# EAGLE design BackupPowerUnit (EAGLE 9.6.2)
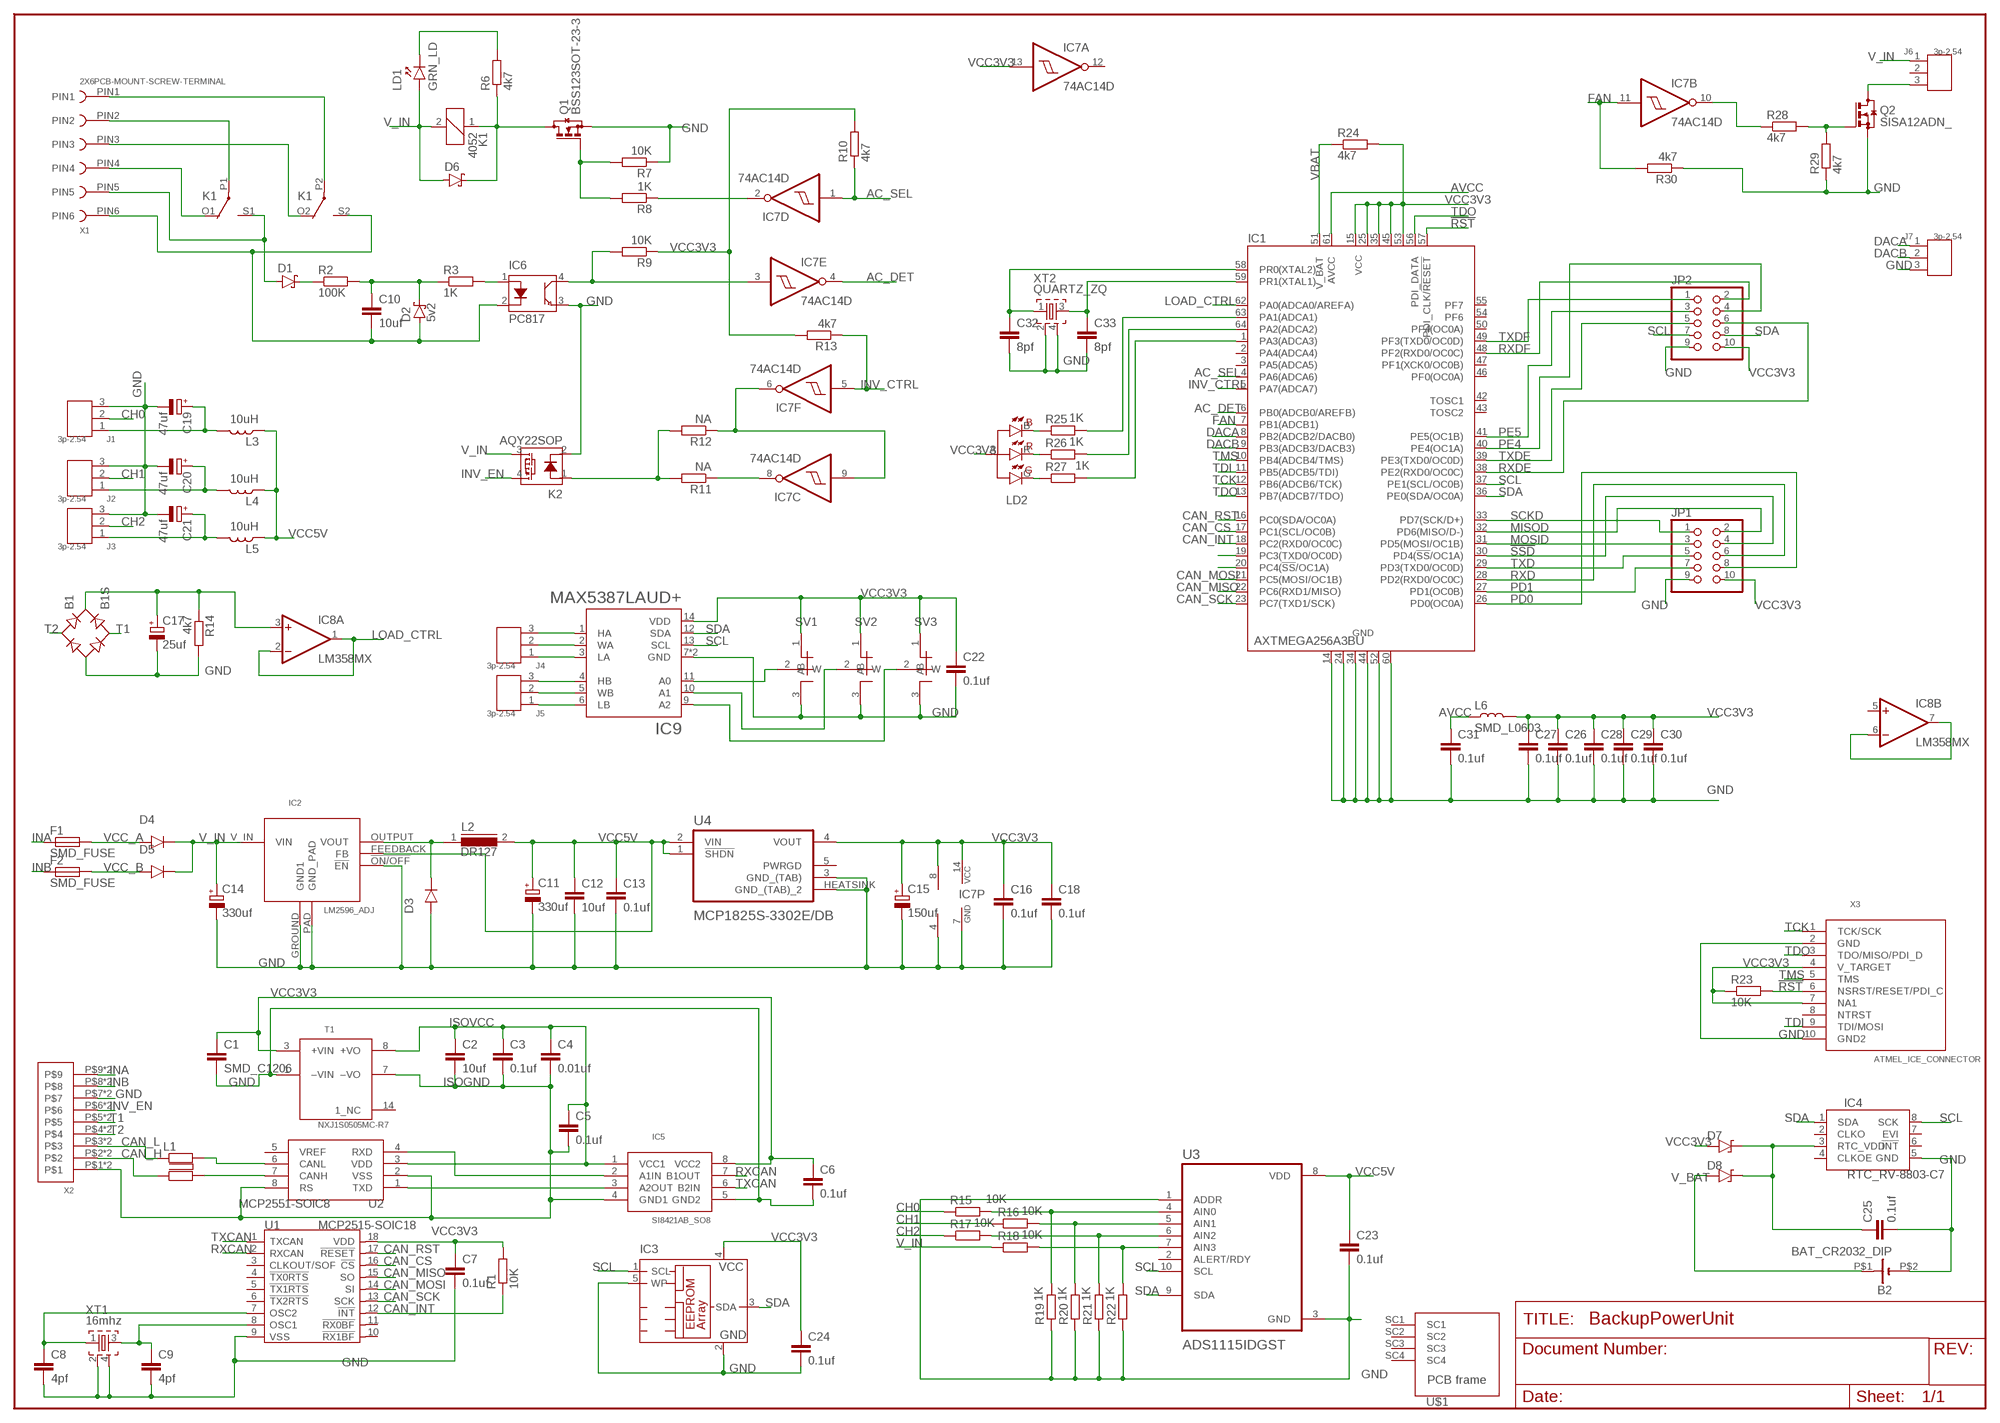
[diagram p0: schematic, sheet 1]

## Parts
B1  B1S  [MBS]
B2  BAT_CR2032_DIP  [CR2032_DIP]
C1  SMD_C1206  [1206]
C2  10uf  SMD_C1206  [1206]
C3  0.1uf  SMD_C0603  [0603]
C4  0.01uf  SMD_C0603  [0603]
C5  0.1uf  SMD_C0603  [0603]
C6  0.1uf  SMD_C0603  [0603]
C7  0.1uf  SMD_C0603  [0603]
C8  4pf  SMD_C0603  [0603]
C9  4pf  SMD_C0603  [0603]
C10  10uf  SMD_C0805  [0805]
C11  330uf  RADIAL_330UF_25V_8MM  [3.6MM]
C12  10uf  SMD_C1206  [1206]
C13  0.1uf  SMD_C0603  [0603]
C14  330uf  RADIAL_330UF_25V_8MM  [3.6MM]
C15  150uf  TANTAL_150UF_3528  [KA-3528ASYC]
C16  0.1uf  SMD_C0603  [0603]
C17  25uf  TANTAL_150UF_3528  [KA-3528ASYC]
C18  0.1uf  SMD_C0603  [0603]
C19  47uf  TANTAL_150UF_3528  [KA-3528ASYC]
C20  47uf  TANTAL_150UF_3528  [KA-3528ASYC]
C21  47uf  TANTAL_150UF_3528  [KA-3528ASYC]
C22  0.1uf  SMD_C0603  [0603]
C23  0.1uf  SMD_C0603  [0603]
C24  0.1uf  SMD_C0603  [0603]
C25  0.1uf  SMD_C0603  [0603]
C26  0.1uf  SMD_C0603  [0603]
C27  0.1uf  SMD_C0603  [0603]
C28  0.1uf  SMD_C0603  [0603]
C29  0.1uf  SMD_C0603  [0603]
C30  0.1uf  SMD_C0603  [0603]
C31  0.1uf  SMD_C0603  [0603]
C32  8pf  SMD_C0603  [0603]
C33  8pf  SMD_C0603  [0603]
D1  1N5819-B  [DO41-7.6]
D2  5v2  1N5819-B  [DO41-7.6]
D3  D_MBRA340G  [SMA403D]
D4  D_MBRA340G  [SMA403D]
D5  D_MBRA340G  [SMA403D]
D6  1N5819-B  [DO41-7.6]
D7  D_SOD323  [SOD-323_D]
D8  D_SOD323  [SOD-323_D]
F1  SMD_FUSE  [SMD_2410_FUSE_NOK]
F2  SMD_FUSE  [SMD_2410_FUSE_NOK]
IC1  AXTMEGA256A3BU  [TQFP64]
IC2  LM2596_ADJ  [DDPAK/TO-263(S)]
IC3  MICROCHIP-24AA01T-I/OT  [SOT-23(5)]
IC4  RTC_RV-8803-C7  [C7_RTC]
IC5  SI8421AB_SO8  [SO8]
IC6  PC817  [DIL4-SMD]
IC7  74AC14D  [SO14]
IC8  LM358MX  [SO08]
IC9  MAX5387LAUD+  [SOP65P640X110-14N]
J1  3p-2.54  DIP-MALE-JST(3P-2.54)  [H3-2.54-7.62X5.8MM]
J2  3p-2.54  DIP-MALE-JST(3P-2.54)  [H3-2.54-7.62X5.8MM]
J3  3p-2.54  DIP-MALE-JST(3P-2.54)  [H3-2.54-7.62X5.8MM]
J4  3p-2.54  DIP-MALE-JST(3P-2.54)  [H3-2.54-7.62X5.8MM]
J5  3p-2.54  DIP-MALE-JST(3P-2.54)  [H3-2.54-7.62X5.8MM]
J6  3p-2.54  DIP-MALE-JST(3P-2.54)  [H3-2.54-7.62X5.8MM]
J7  3p-2.54  DIP-MALE-JST(3P-2.54)  [H3-2.54-7.62X5.8MM]
JP1  PINHD-2X5  [2X05]
JP2  PINHD-2X5  [2X05]
K1  4052  [F4052]
K2  AQY22SOP  [SOP04]
L1  EPCOS_B82793_FILTER  [EPCOS_FILTER]
L2  DR127  [DR127]
L3  10uH  SMD_L0603  [0603]
L4  10uH  SMD_L0603  [0603]
L5  10uH  SMD_L0603  [0603]
L6  SMD_L0603  [0603]
LD1  GRN_LD  LED0603  [0603_P]
LD2  LTSN-N213EGBW(RGB_LED)  [LTSN-N213EGBW]
Q1  BSS123SOT-23-3  [SOT-23(3)]
Q2  SISA12ADN_  [VISHAY_SIS468DN-T1-GE3]
R1  10K  SMD_R0603  [0603]
R2  100K  R-EU_0204/7  [0204/7]
R3  1K  SMD_R0603  [0603]
R6  4k7  SMD_R0603  [0603]
R7  10K  SMD_R0603  [0603]
R8  1K  SMD_R0603  [0603]
R9  10K  SMD_R0603  [0603]
R10  4k7  SMD_R0603  [0603]
R11  NA  SMD_R0603  [0603]
R12  NA  SMD_R0603  [0603]
R13  4k7  SMD_R0603  [0603]
R14  4k7  SMD_R0603  [0603]
R15  10K  SMD_R0603  [0603]
R16  10K  SMD_R0603  [0603]
R17  10K  SMD_R0603  [0603]
R18  10K  SMD_R0603  [0603]
R19  1K  SMD_R0603  [0603]
R20  1K  SMD_R0603  [0603]
R21  1K  SMD_R0603  [0603]
R22  1K  SMD_R0603  [0603]
R23  10K  SMD_R0603  [0603]
R24  4k7  SMD_R0603  [0603]
R25  1K  SMD_R0603  [0603]
R26  1K  SMD_R0603  [0603]
R27  1K  SMD_R0603  [0603]
R28  4k7  SMD_R0603  [0603]
R29  4k7  SMD_R0603  [0603]
R30  4k7  SMD_R0603  [0603]
SV1  SMD_SWITCH_JUMPER  [0603_JUMP]
SV2  SMD_SWITCH_JUMPER  [0603_JUMP]
SV3  SMD_SWITCH_JUMPER  [0603_JUMP]
T1  NXJ1S0505MC-R7  [NXJ1SXXXXMC]
U1  MCP2515-SOIC18  [SO18L]
U2  MCP2551-SOIC8  [SO8]
U3  ADS1115IDGST  [SOP50P490X110-10N]
U4  MCP1825S-3302E/DB  [SOT230P700X180-4N]
U$1  JLC_PCB_FRAME80X100_FRAME  [80X100_PCB_FRAME]
X1  2X6PCB-MOUNT-SCREW-TERMINAL  [2X6PCB-MOUNT-SCREW-TERMINAL]
X2  WAGO250_X9  [WAGO250_FP_9X]
X3  ATMEL_ICE_CONNECTOR  [MINI10P_SPI/JTAG/PDI]
XT1  16mhz  QUARTZ_ZQ  [QUARTZ_3X3MM]
XT2  QUARTZ_ZQ  [QUARTZ_3X3MM]

## Nets
!RST: IC1.57(PDI_CLK/!RESET!) R23.2 X3.6(NSRST/RESET/PDI_C)
!SSD: IC1.30(PD4(!SS!/OC1A)) JP1.4
AC_DET: IC1.6(PB0(ADCB0/AREFB)) IC7.4(E:O)
AC_SEL: IC1.4(PA6(ADCA6)) IC7.1(D:I) R10.1
AVCC: C31.1 IC1.61(AVCC) L6.1
CAN_CS: IC1.17(PC1(SCL/OC0B)) U1.16(!CS)
CAN_H: L1.P$2 X2.P$2 X2.U$2
CAN_INT: IC1.18(PC2(RXD0/OC0C)) R1.1 U1.12(!INT)
CAN_L: L1.P$1 X2.P$3 X2.U$3
CAN_MISO: IC1.22(PC6(RXD1/MISO)) U1.15(SO)
CAN_MOSI: IC1.21(PC5(MOSI/OC1B)) U1.14(SI)
CAN_RST: IC1.16(PC0(SDA/OC0A)) U1.17(!RESET)
CAN_SCK: IC1.23(PC7(TXD1/SCK)) U1.13(SCK)
CH0: J1.2 R15.1
CH1: J2.2 R16.1
CH2: J3.2 R17.1
DACA: IC1.8(PB2(ADCB2/DACB0)) J7.1
DACB: IC1.9(PB3(ADCB3/DACB3)) J7.2
FAN: IC1.7(PB1(ADCB1)) IC7.11(B:I) R30.2
GND: B1.- B2.P$2(-) C1.2 C6.2 C7.2 C8.2 C9.2 C11.P$1(-) C12.2 C13.2 C14.P$1(-) C15.M(-) C16.2 C17.M(-) C18.2 C19.M(-) C20.M(-) C21.M(-) C22.2 C23.2 C24.2 C25.2 C26.2 C27.2 C28.2 C29.2 C30.2 C31.2 C32.2 C33.2 D3.P$2(A) IC1.14(GND1) IC1.24(GND2) IC1.34(GND3) IC1.44(GND4) IC1.52(GND5) IC1.60(GND6) IC2.!ON/OFF(!EN!) IC2.GROUND(GND1) IC2.PAD(GND_PAD) IC3.2(GND) IC3.5(WP) IC4.5(GND) IC5.5(GND2) IC6.3(E) IC7.7(P:GND) IC8.4(P:V-) IC9.7(GND) IC9.8(GND) J1.3 J2.3 J3.3 J7.3 JP1.9 JP2.9 K2.2(K) Q1.2(S) Q2.1(S) Q2.2(S) Q2.3(S) R7.1 R14.2 R19.1 R20.1 R21.1 R22.1 R29.1 R30.1 SV1.3(B) SV2.3(B) SV3.3(B) T1.1(–VIN) U1.9(VSS) U3.1(ADDR) U3.3(GND) U4.3(GND_(TAB)) U4.HEATSINK(GND_(TAB)_2) X2.P$7 X2.U$7 X3.2(GND) X3.10(GND2) XT1.2 XT1.4 XT2.2 XT2.4
INA: F1.P$1 X2.P$9 X2.U$9
INB: F2.P$1 X2.P$8 X2.U$8
INV_CTRL: IC1.5(PA7(ADCA7)) IC7.5(F:I) R13.1
INV_EN: K2.4(DS1) X2.P$6 X2.U$6
ISOGND: C2.2 C3.2 C4.2 C5.2 IC5.4(GND1) T1.7(–VO) U2.2(VSS) U2.8(RS) X2.P$1 X2.U$1
ISOVCC: C2.1 C3.1 C4.1 C5.1 IC5.1(VCC1) T1.8(+VO) U2.3(VDD)
LOAD_CTRL: IC1.62(PA0(ADCA0/AREFA)) IC8.1(A:OUT) IC8.2(A:-IN)
MISOD: IC1.32(PD6(MISO/D-)) JP1.2
MOSID: IC1.31(PD5(MOSI/OC1B)) JP1.3
N$1: D1.A K1.S1(2:S) X1.PIN5
N$2: K1.O1(2:O) X1.PIN4
N$3: K1.O2(3:O) X1.PIN3
N$4: Q1.1(G) R7.2 R8.2
N$5: K1.P1(2:P) X1.PIN2
N$6: K1.P2(3:P) X1.PIN1
N$7: L1.P$3 U2.7(CANH)
N$8: L1.P$4 U2.6(CANL)
N$9: IC7.6(F:O) IC7.9(C:I) R12.1
N$10: IC6.4(C) IC7.3(E:I) R9.2
N$11: IC5.2(A1IN) U2.4(RXD)
N$12: C9.1 U1.8(OSC1) XT1.3
N$13: C8.1 U1.7(OSC2) XT1.1
N$14: IC5.3(A2OUT) U2.1(TXD)
N$15: IC6.1(ANODE) R3.2
N$16: D3.P$1(C) IC2.OUTPUT(VOUT) L2.1
N$17: C10.2 D2.A IC6.2(KATODE) K1.S2(3:S) X1.PIN6
N$18: D1.C R2.1
N$19: C10.1 D2.C R2.2 R3.1
N$21: LD1.1(K) R6.2
N$22: D6.C K1.1 Q1.3(D) R6.1
N$23: IC7.2(D:O) R8.1
N$24: K2.1(A) R11.2 R12.2
N$25: IC7.8(C:O) R11.1
N$26: IC9.11(A0) SV1.2(W)
N$27: IC8.6(B:-IN) IC8.7(B:OUT)
N$28: B1.+ C17.P(+) IC8.3(A:+IN) R14.1
N$29: C19.P(+) J1.1 L3.2
N$30: IC9.10(A1) SV2.2(W)
N$31: C20.P(+) J2.1 L4.2
N$32: IC9.9(A2) SV3.2(W)
N$33: C21.P(+) J3.1 L5.2
N$34: C25.1 D7.K D8.K IC4.3(RTC_VDD)
N$35: IC9.1(HA) J4.3
N$36: IC9.2(WA) J4.2
N$37: IC7.10(B:O) R28.1
N$38: IC9.3(LA) J4.1
N$39: IC9.4(HB) J5.3
N$40: IC9.5(WB) J5.2
N$41: IC9.6(LB) J5.1
N$43: C33.1 IC1.59(PR1(XTAL1)) XT2.3
N$44: R15.2 R19.2 U3.4(AIN0)
N$45: R16.2 R20.2 U3.5(AIN1)
N$46: R17.2 R21.2 U3.6(AIN2)
N$47: R18.2 R22.2 U3.7(AIN3)
N$48: IC1.19(PC3(TXD0/OC0D))
N$49: IC1.20(PC4(!SS!/OC1A))
N$50: C32.1 IC1.58(PR0(XTAL2)) XT2.1
N$51: LD2.B(BC) R25.1
N$52: LD2.R(RC) R26.1
N$53: LD2.G(GC) R27.1
N$54: IC1.63(PA1(ADCA1)) R25.2
N$55: IC1.64(PA2(ADCA2)) R26.2
N$56: IC1.1(PA3(ADCA3)) R27.2
N$57: J6.3 Q2.5(D) Q2.6(D) Q2.7(D) Q2.8(D) Q2.9(D)
N$59: Q2.4(G) R28.2 R29.2
PD0: IC1.26(PD0(OC0A)) JP1.8
PD1: IC1.27(PD1(OC0B)) JP1.7
PE4: IC1.40(PE4(OC1A)) JP2.4
PE5: IC1.41(PE5(OC1B)) JP2.3
RXCAN: IC5.7(B1OUT) U1.2(RXCAN)
RXD: IC1.28(PD2(RXD0/OC0C)) JP1.6
RXDE: IC1.38(PE2(RXD0/OC0C)) JP2.6
RXDF: IC1.48(PF2(RXD0/OC0C)) JP2.2
SCKD: IC1.33(PD7(SCK/D+)) JP1.1
SCL: IC1.37(PE1(SCL/OC0B)) IC3.1(SCL) IC4.8(SCK) IC9.13(SCL) JP2.7 U3.10(SCL)
SDA: IC1.36(PE0(SDA/OC0A)) IC3.3(SDA) IC4.1(SDA) IC9.12(SDA) JP2.8 U3.9(SDA)
T1: B1.AC2 X2.P$5 X2.U$5
T2: B1.AC1 X2.P$4 X2.U$4
TCK: IC1.12(PB6(ADCB6/TCK)) X3.1(TCK/SCK)
TDI: IC1.11(PB5(ADCB5/TDI)) X3.9(TDI/MOSI)
TDO: IC1.13(PB7(ADCB7/TDO)) IC1.56(PDI_DATA) X3.3(TDO/MISO/PDI_D)
TMS: IC1.10(PB4(ADCB4/TMS)) X3.5(TMS)
TXCAN: IC5.6(B2IN) U1.1(TXCAN)
TXD: IC1.29(PD3(TXD0/OC0D)) JP1.5
TXDE: IC1.39(PE3(TXD0/OC0D)) JP2.5
TXDF: IC1.49(PF3(TXD0/OC0D)) JP2.1
V_BAT: B2.P$1(+) D8.A
V_IN: C14.P$2(+) D4.P$1(C) D5.P$1(C) D6.A IC2.V_IN(VIN) J6.1 K1.2 K2.3(DS2) LD1.2(A) R18.1
VBAT: IC1.51(V_BAT) R24.1
VCC3V3: C1.1 C6.1 C7.1 C15.P(+) C16.1 C18.1 C22.1 C24.1 C26.1 C27.1 C28.1 C29.1 C30.1 D7.A IC1.15(VCC1) IC1.25(VCC2) IC1.35(VCC3) IC1.45(VCC4) IC1.53(VCC5) IC3.4(VCC) IC5.8(VCC2) IC7.13(A:I) IC7.14(P:VCC) IC8.8(P:V+) IC9.14(VDD) JP1.10 JP2.10 L6.2 LD2.A R1.2 R9.1 R10.2 R13.2 R23.1 R24.2 SV1.1(A) SV2.1(A) SV3.1(A) T1.3(+VIN) U1.18(VDD) U4.4(VOUT) X3.4(V_TARGET) X3.7(NA1)
VCC5V: C11.P$2(+) C12.1 C13.1 C23.1 IC2.FEEDBACK(FB) L2.2 L3.1 L4.1 L5.1 U3.8(VDD) U4.1(!SHDN) U4.2(VIN)
VCC_A: D4.P$2(A) F1.P$2
VCC_B: D5.P$2(A) F2.P$2
Unconnected: IC1.2(PA4(ADCA4)) IC1.3(PA5(ADCA5)) IC1.42(TOSC1) IC1.43(TOSC2) IC1.46(PF0(OC0A)) IC1.47(PF1(XCK0/OC0B)) IC1.50(PF4(OC0A)) IC1.54(PF6) IC1.55(PF7) IC4.2(CLKO) IC4.4(CLKOE) IC4.6(!INT) IC4.7(EVI) IC7.12(A:O) IC8.5(B:+IN) J6.2 T1.14(1_NC) U1.3(CLKOUT/SOF) U1.4(!TX0RTS) U1.5(!TX1RTS) U1.6(!TX2RTS) U1.10(!RX1BF) U1.11(!RX0BF) U2.5(VREF) U3.2(ALERT/RDY) U4.5(PWRGD) U$1.SC1 U$1.SC2 U$1.SC3 U$1.SC4 X3.8(NTRST)

## Library data of the parts
B1 = rectifier:B*S: Surface Mount Glass Passivated Bridge Rectifiers Source: Comchip Bridge Rectifiers B05S-G_B10S-G.pdf
B2 = passive_components:BAT_CR2032_DIP
C1-C10 C12 C13 C16 C18 C22-C33 = passive_components:SMD_C
C11 C14 = passive_components:RADIAL_330UF_25V_8MM
C15 C17 C19-C21 = passive_components:TANTAL_150UF_3528
D1 D2 D6 = diode:1N581*: 1.0A SCHOTTKY BARRIER RECTIFIER Source: http://www.diodes.com/datasheets/ds23001.pdf
D3-D5 = passive_components:D_MBRA340G
D7 D8 = rcl:D_SOD323
F1 F2 = passive_components:SMD_FUSE
IC1 = my_IC:AXTMEGA256A3BU: MICROCONTROLLER Low-voltage (L) 256 Kbytes FLASH 8KBytes boot section 4KBytes EEPROM 16KBytes internal SRAM
IC2 = my_IC:LM2596_ADJ: DC-DC step down ic
IC3 = my_IC:MICROCHIP-24AA01T-I/OT
IC4 = my_IC:RTC_RV-8803-C7
IC5 = my_IC:SI8421AB_SO8
IC6 = relays:PC817
IC7 = my_IC:74*14: Hex schmitt trigger INVERTER
IC8 = linear:LM358: OP AMP also LM158; LM258; LM2904 Source: http://cache.national.com/ds/LM/LM158.pdf
IC9 = my_IC:MAX5387LAUD+
J1-J7 = Custom connectors:DIP-MALE-JST(3P-2.54): 320110092; MPN: MC34631
JP1 JP2 = pinhead:PINHD-2X5: PIN HEADER
K1 = relay:4052: RELAY 2 x switch, Finder; OC_FARNELL: unknown; OC_NEWARK: unknown
K2 = relays:AQY*: PhotoMOS Relay NAiS Source: http://www.panasonic-electric-works.com/catalogues/downloads/photomos/ds_x615_en_aqz10_20.pdf; OC_FARNELL: unknown; OC_NEWARK: unknown
L1 = passive_components:EPCOS_B82793_FILTER
L2 = inductors:DR127: High Power Density, High Efficiency, Shielded Inductors Source: coiltronics_dr_series.pdf; SPICEPREFIX: L
L3-L6 = passive_components:SMD_L
LD1 = passive_components:LED
LD2 = passive_components:LTSN-N213EGBW(RGB_LED)
Q1 = passive_components:BSS123: N-CHANNEL MOS FET
Q2 = passive_components:SISA12ADN
R1 R3 R6-R30 = passive_components:SMD_R
R2 = rcl:R-EU_: RESISTOR, European symbol
SV1-SV3 = passive_components:SMD_SWITCH_JUMPER
T1 = Tracopower - TSM 0505S:NXJ1S0505MC-R7: № Mouser:580-NXJ1S0505MC-R7 № произв.: NXJ1S0505MC-R7 Произв.:Murata Power Solutions Номер клиента: Номер клиента Описание: Преобразователи постоянного тока в постоянный с изоляцией 1W 5Vin 5Vout 200mA SM
U1 = my_IC:MCP2515: Stand-Alone CAN Controller With SPI Interface
U2 = my_IC:MCP2551: High-Speed CAN Transceiver http://ww1.microchip.com/downloads/en/devicedoc/21667f.pdf
U3 = ADS1115IDGST:ADS1115IDGST: Check prices <https://pricing.snapeda.com/parts/ADS1115IDGST/Texas%20Instruments/view-part?ref=eda>; AVAILABILITY: In Stock; DESCRIPTION: 16-Bit 860SPS 4-Ch Delta-Sigma ADC With PGA, Oscillator, Vref, Comparator, and I2C 10-VSSOP -40 to 125; MF: Texas Instruments; MP: ADS1115IDGST; PACKAGE: VSSOP-10 Texas Instruments; PRICE: None; PURCHASE-URL: https://pricing.snapeda.com/search/part/ADS1115IDGST/?ref=eda
U4 = my_IC:MCP1825S-3302E/DB; AVAILABILITY: Unavailable; DESCRIPTION: Linear Voltage Regulator IC 1 Output 500mA SOT-223-3; MF: Microchip; MP: MCP1825S-3302E/DB; PACKAGE: SOT-223 Microchip; PRICE: None
U$1 = passive_components:JLC_PCB_FRAME
X1 = Custom connectors:2X6PCB-MOUNT-SCREW-TERMINAL
X2 = Custom connectors:WAGO250_X9
X3 = passive_components:ATMEL_ICE_CONNECTOR
XT1 XT2 = passive_components:QUARTZ_ZQ

## Board
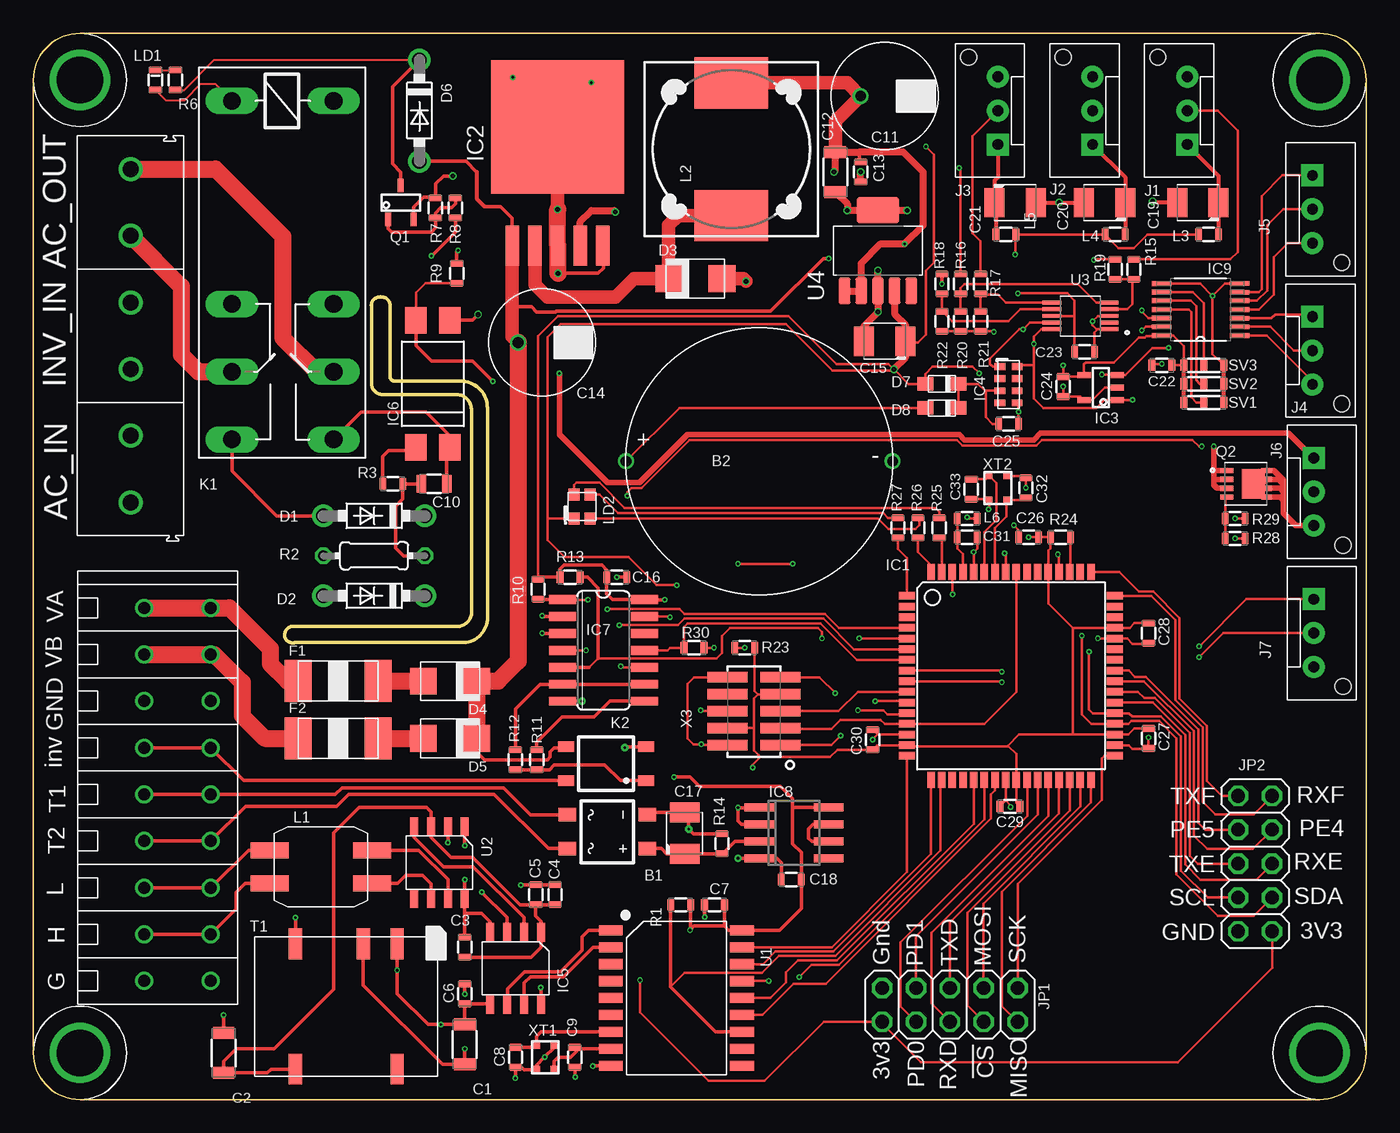
[diagram p1: board, top side]
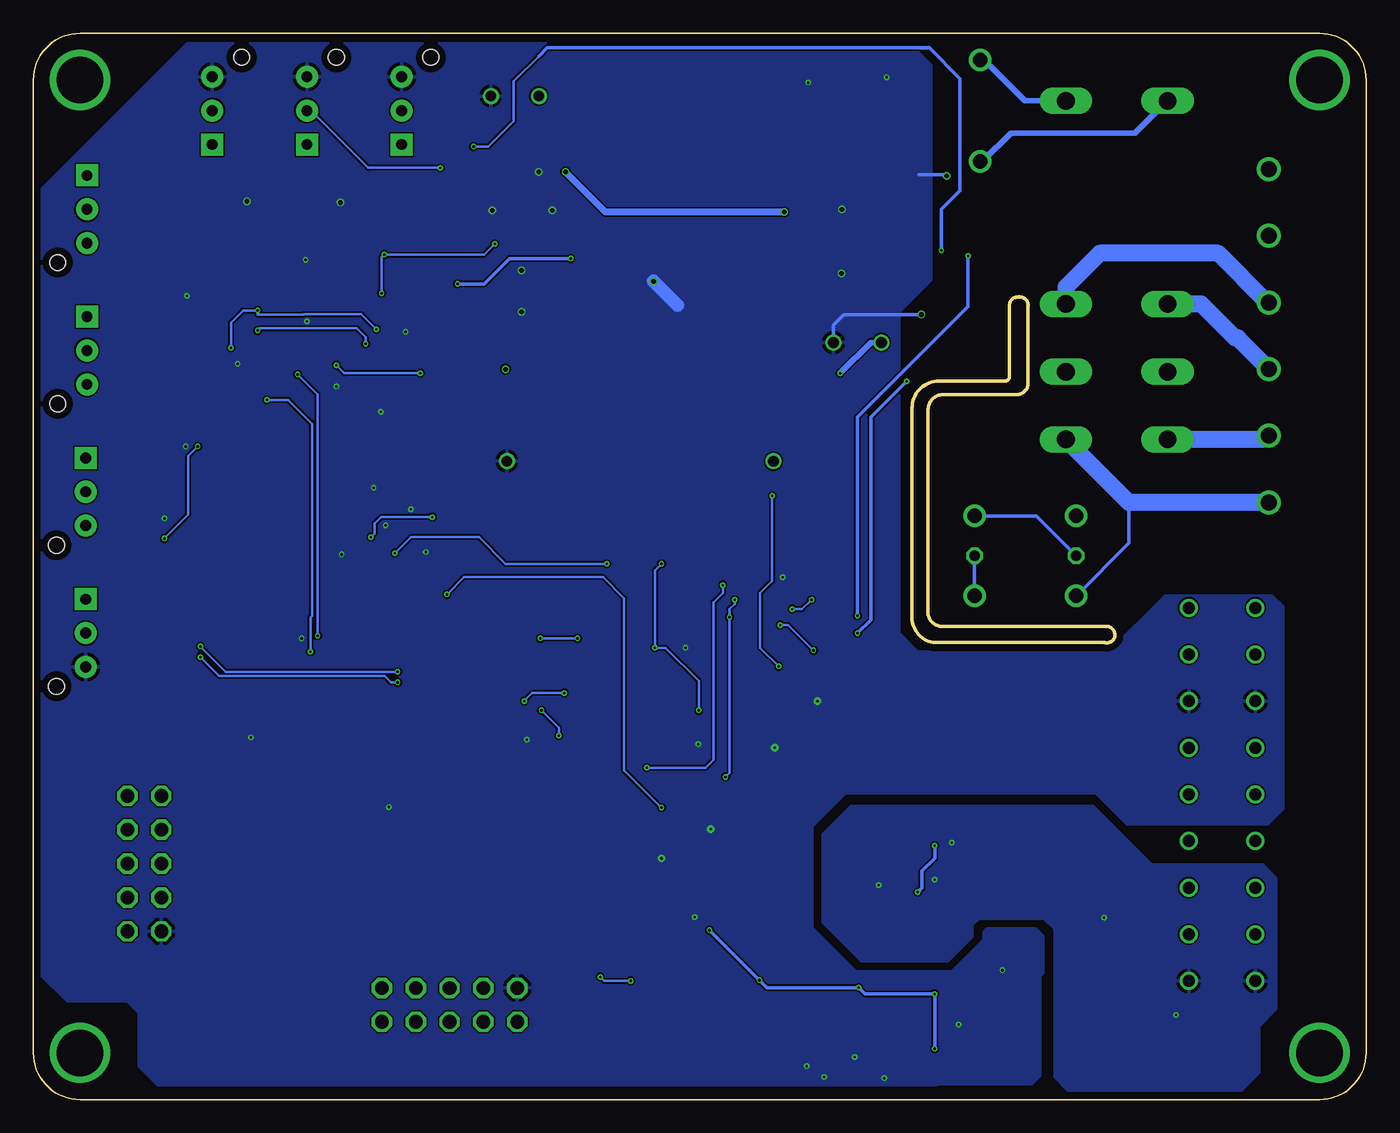
[diagram p2: board, bottom side, seen from below]

Size 100 x 80 mm. Coordinates in mm from the lower left corner, seen from the top.
Outline: 19.47,35.5 31.97,35.5 arc90 32.87,36.8 32.87,51.7 arc90 31.77,52.9 26.17,52.9 arc-90 25.37,53.8 25.37,59.5 arc-90 25.87,60.2 arc-90 26.77,59.7 26.77,54.2 arc90 27.17,53.9 32.07,53.9 arc-90 34.07,51.9 34.07,36.5 arc-90 32.47,34.3 19.67,34.3 arc-90 18.87,34.7 18.87,34.9 arc-90 19.47,35.5
Copper layers (1*16): Top 0.035mm / dielectric 1.5mm / Bottom 0.035mm
Design rules "default *": minimum track width 6mil, minimum drill 0.2mm, track to track 5mil, track to pad 5mil, pad to pad 5mil, via to via 5mil, smd to smd 5mil, copper to edge 20mil, drill to drill 6mil, minimum pad ring 4mil, minimum via ring 4mil, stop-mask expansion 4mil, vias tented up to drill 20mil, thermal gap 10mil

### Footprints (pad centres in the part's own frame; a part is rotated, then mirrored left to right if it is on the bottom)
MBS = smd 1 x 1.3: + -1.27,-3; - 1.27,-3; AC1 -1.27,3; AC2 1.27,3
CR2032_DIP = drill 0.8: P$1 -10,0; P$2 10,0
1206 = smd 1.6 x 0.9: 1 0,1.5; 2 0,-1.5
0603 = smd 0.85 x 0.5: 1 0,0.75; 2 0,-0.75
0805 = smd 1.3 x 0.7: 1 0,0.95; 2 0,-0.95
3.6MM = drill 0.8: P$1 -1.8,0; P$2 1.8,0
KA-3528ASYC = smd 1.5 x 2.2: M -1.55,0; P 1.55,0
DO41-7.6 = drill 1.1 pad 1.7: A 3.81,0; C -3.81,0
SMA403D = smd 2 x 2: P$1 -2,0; P$2 2,0
SOD-323_D = smd 1.2 x 1: A 1.25,0; K -1.25,0
SMD_2410_FUSE_NOK = smd 2 x 3.15: P$1 -3,0; P$2 3,0
TQFP64 = smd 1.194 x 0.559: 1 -7.8,6; 2 -7.8,5.2; 3 -7.8,4.4; 4 -7.8,3.6; 5 -7.8,2.8; 6 -7.8,2; 7 -7.8,1.2; 8 -7.8,0.4; 9 -7.8,-0.4; 10 -7.8,-1.2; 11 -7.8,-2; 12 -7.8,-2.8; 13 -7.8,-3.6; 14 -7.8,-4.4; 15 -7.8,-5.2; 16 -7.8,-6; 33 7.8,-6; 34 7.8,-5.2; 35 7.8,-4.4; 36 7.8,-3.6; 37 7.8,-2.8; 38 7.8,-2; 39 7.8,-1.2; 40 7.8,-0.4; 41 7.8,0.4; 42 7.8,1.2; 43 7.8,2; 44 7.8,2.8; 45 7.8,3.6; 46 7.8,4.4; 47 7.8,5.2; 48 7.8,6 | smd 0.559 x 1.194: 17 -6,-7.8; 18 -5.2,-7.8; 19 -4.4,-7.8; 20 -3.6,-7.8; 21 -2.8,-7.8; 22 -2,-7.8; 23 -1.2,-7.8; 24 -0.4,-7.8; 25 0.4,-7.8; 26 1.2,-7.8; 27 2,-7.8; 28 2.8,-7.8; 29 3.6,-7.8; 30 4.4,-7.8; 31 5.2,-7.8; 32 6,-7.8; 49 6,7.8; 50 5.2,7.8; 51 4.4,7.8; 52 3.6,7.8; 53 2.8,7.8; 54 2,7.8; 55 1.2,7.8; 56 0.4,7.8; 57 -0.4,7.8; 58 -1.2,7.8; 59 -2,7.8; 60 -2.8,7.8; 61 -3.6,7.8; 62 -4.4,7.8; 63 -5.2,7.8; 64 -6,7.8
DDPAK/TO-263(S) = smd 1 x 3: !ON/OFF 3.85,-8.84; FEEDBACK 2.15,-8.84; GROUND 0.45,-8.84; OUTPUT -1.25,-8.84; V_IN -2.95,-8.84 | smd 10 x 10: PAD 0.45,0.06
SOT-23(5) = smd 0.45 x 1: 1 -0.95,-1.25; 2 0,-1.25; 3 0.95,-1.25; 4 0.95,1.25; 5 -0.95,1.25
C7_RTC = smd 0.8 x 0.5: 1 -0.65,1.35; 2 -0.65,0.45; 3 -0.65,-0.45; 4 -0.65,-1.35; 5 0.65,-1.35; 6 0.65,-0.45; 7 0.65,0.45; 8 0.65,1.35
SO8 = smd 0.6 x 1.4: 1 -1.905,-2.7; 2 -0.635,-2.7; 3 0.635,-2.7; 4 1.905,-2.7; 5 1.905,2.7; 6 0.635,2.7; 7 -0.635,2.7; 8 -1.905,2.7
DIL4-SMD = smd 1.6 x 2: 1 -1.27,-4.77; 2 1.27,-4.77; 3 1.27,4.77; 4 -1.27,4.77
SO14 = smd 0.66 x 2.032: 1 -3.81,-3.073; 2 -2.54,-3.073; 3 -1.27,-3.073; 4 0,-3.073; 5 1.27,-3.073; 6 2.54,-3.073; 7 3.81,-3.073; 8 3.81,3.073; 9 2.54,3.073; 10 1.27,3.073; 11 0,3.073; 12 -1.27,3.073; 13 -2.54,3.073; 14 -3.81,3.073
SO08 = smd 0.6 x 2.2: 1 -1.905,-2.6; 2 -0.635,-2.6; 3 0.635,-2.6; 4 1.905,-2.6; 5 1.905,2.6; 6 0.635,2.6; 7 -0.635,2.6; 8 -1.905,2.6
SOP65P640X110-14N = smd 1.473 x 0.356: 1 -2.921,3.581; 2 -2.921,2.921; 3 -2.921,2.286; 4 -2.921,1.626; 5 -2.921,0.965; 6 -2.921,0.33; 7 -2.921,-0.33; 8 2.929,-0.315; 9 2.929,0.324; 10 2.929,0.964; 11 2.929,1.629; 12 2.929,2.269; 13 2.921,2.919; 14 2.921,3.579
H3-2.54-7.62X5.8MM = drill 0.813 pad 1.651 square: 1 2.54,0 | drill 0.813 pad 1.651: 2 0,0; 3 -2.54,0 | hole 1.2: -4,-2.2
2X05 = drill 1.016 octagon: 1 -5.08,-1.27; 2 -5.08,1.27; 3 -2.54,-1.27; 4 -2.54,1.27; 5 0,-1.27; 6 0,1.27; 7 2.54,-1.27; 8 2.54,1.27; 9 5.08,-1.27; 10 5.08,1.27
F4052 = drill 1.321 long: 1 -3.81,3.81; 2 -3.81,-3.81; O1 11.43,-3.81; O2 11.43,3.81; P1 16.51,-3.81; P2 16.51,3.81; S1 21.59,-3.81; S2 21.59,3.81
SOP04 = smd 0.8 x 1.2: 1 -1.27,-3; 2 1.27,-3; 3 1.27,3; 4 -1.27,3
EPCOS_FILTER = smd 2.85 x 1.2: P$1 -3.85,1.25; P$2 -3.85,-1.25; P$3 3.85,1.25; P$4 3.85,-1.25
DR127 = smd 3.85 x 5.5: 1 -4.975,0; 2 4.975,0
0603_P = smd 0.85 x 0.5: 1 0,0.75; 2 0,-0.75
LTSN-N213EGBW = smd 0.9 x 0.8: A 0.9,-0.6; B -0.9,-0.6; G -0.9,0.6; R 0.9,0.6
SOT-23(3) = smd 0.45 x 1: 1 -0.95,-1.25; 2 0.95,-1.25; 3 0,1.29
VISHAY_SIS468DN-T1-GE3 = smd 0.99 x 0.405: 1 -1.435,0.99; 2 -1.435,0.33; 3 -1.435,-0.33; 4 -1.435,-0.99 | smd 0.76 x 0.405: 5 1.55,-0.99; 6 1.55,-0.33; 7 1.55,0.33; 8 1.55,0.99 | smd 1.725 x 2.235: 9 0.557,0
0204/7 = drill 0.813 octagon: 1 -3.81,0; 2 3.81,0
0603_JUMP = smd 0.85 x 0.5: 1 0,0.75; 2 0,-0.75; 3 0,-2.25
NXJ1SXXXXMC = smd 1 x 2.3: 1 -3.81,-4.7; 3 -1.27,-4.7; 7 3.81,-4.7; 8 3.81,4.7; 14 -3.81,4.7
SO18L = smd 0.762 x 1.778: 1 -5.08,-4.915; 2 -3.81,-4.915; 3 -2.54,-4.915; 4 -1.27,-4.915; 5 0,-4.915; 6 1.27,-4.915; 7 2.54,-4.915; 8 3.81,-4.915; 9 5.08,-4.915; 10 5.08,4.915; 11 3.81,4.915; 12 2.54,4.915; 13 1.27,4.915; 14 0,4.915; 15 -1.27,4.915; 16 -2.54,4.915; 17 -3.81,4.915; 18 -5.08,4.915
SOP50P490X110-10N = smd 1.47 x 0.28: 1 -2.15,1; 2 -2.15,0.5; 3 -2.15,0; 4 -2.15,-0.5; 5 -2.15,-1; 6 2.15,-1; 7 2.15,-0.5; 8 2.15,0; 9 2.15,0.5; 10 2.15,1
SOT230P700X180-4N = smd 1.97 x 0.89: 1 -3.025,2.5; 2 -3.025,1.25; 3 -3.025,0; 4 -3.025,-1.25; 5 -3.025,-2.5 | smd 1.97 x 3.19: HEATSINK 3.025,0
80X100_PCB_FRAME = drill 3.5: SC1 3.5,96.5; SC2 76.5,96.5; SC3 3.5,3.5; SC4 76.5,3.5
2X6PCB-MOUNT-SCREW-TERMINAL = drill 1.2: PIN1 0,2.5; PIN2 0,-2.5; PIN3 0,-7.5; PIN4 0,-12.5; PIN5 0,-17.5; PIN6 0,-22.5
WAGO250_FP_9X = drill 0.9: P$1 0,5; P$2 3.5,5; P$3 7,5; P$4 10.5,5; P$5 14,5; P$6 17.5,5; P$7 21,5; P$8 24.5,5; P$9 28,5; U$1 0,0; U$2 3.5,0; U$3 7,0; U$4 10.5,0; U$5 14,0; U$6 17.5,0; U$7 21,0; U$8 24.5,0; U$9 28,0
MINI10P_SPI/JTAG/PDI = smd 0.8 x 3: 1 0,-4; 2 0,0; 3 1.27,-4; 4 1.27,0; 5 2.54,-4; 6 2.54,0; 7 3.81,-4; 8 3.81,0; 9 5.08,-4; 10 5.08,0
QUARTZ_3X3MM = smd 0.5 x 0.5: 1 -0.65,0.9; 2 0.65,0.9; 3 0.65,-0.9; 4 -0.65,-0.9

### Placement (x,y rotation side)
B1  43.07,20.1 90 top
B2  54.47,47.9 0 top
C1  32.37,4.13 180 top
C2  14.28,3.49 180 top
C3  32.37,11.43 180 top
C4  39.15,15.39 180 top
C5  37.69,15.37 180 top
C6  32.37,7.94 0 top
C7  51.11,14.61 270 top
C8  36.18,3.17 0 top
C9  40.63,3.17 0 top
C10  30.07,46.2 90 top
C11  63.87,75.3 180 top
C12  60.17,69.6 0 top
C13  62.07,69.6 0 top
C14  38.17,56.8 180 top
C15  63.87,56.9 0 top
C16  43.77,39.2 90 top
C17  48.87,20 270 top
C18  56.87,16.5 270 top
C19  87.37,67.3 0 top
C20  80.37,67.3 0 top
C21  73.67,67.3 180 top
C22  84.67,55.1 270 top
C23  78.87,56.1 90 top
C24  77.27,53.5 0 top
C25  73.17,50.7 90 top
C26  74.67,42.2 270 top
C27  83.67,27.1 0 top
C28  83.67,35 0 top
C29  73.27,22 270 top
C30  62.97,27 180 top
C31  70.07,42.2 90 top
C32  74.47,45.9 180 top
C33  70.37,45.8 0 top
D1  25.57,43.8 180 top
D2  25.57,37.8 180 top
D3  49.67,61.6 0 top
D4  31.27,31.4 180 top
D5  31.27,27.1 180 top
D6  28.97,74.2 270 top
D7  68.17,53.7 180 top
D8  68.17,51.9 180 top
F1  22.87,31.4 0 top
F2  22.87,27.1 0 top
IC1  73.35,31.79 0 top
IC2  38.89,72.92 0 top
IC3  80.09,53.42 90 top
IC4  73.17,53.64 0 top
IC5  36.18,9.84 180 top
IC6  29.97,53.7 0 top
IC7  42.77,33.7 270 top
IC8  57.07,20 270 top
IC9  87.57,60.9 180 top
J1  86.57,74.2 270 top
J2  79.47,74.2 270 top
J3  72.37,74.2 270 top
J4  95.97,56.2 90 top
J5  95.97,66.8 90 top
J6  96.07,45.6 90 top
J7  96.07,35 90 top
JP1  68.77,7.1 180 top
JP2  91.67,17.7 270 top
K1  18.72,71.12 270 top
K2  42.97,25.2 90 top
L1  21.58,17.46 0 top
L2  52.37,71.3 90 top
L3  88.17,64.9 90 top
L4  81.17,64.9 90 top
L5  72.97,64.9 270 top
L6  70.07,43.6 90 top
LD1  9.17,76.5 0 top
LD2  41.17,44.5 270 top
Q1  27.57,67.3 0 top
Q2  90.97,46.2 0 top
R1  48.57,14.61 90 top
R2  25.57,40.8 0 top
R3  26.97,46.2 270 top
R6  10.67,76.5 180 top
R7  30.17,66.9 0 top
R8  31.67,66.9 180 top
R9  31.77,62 0 top
R10  37.87,38.3 180 top
R11  37.77,25.5 0 top
R12  36.17,25.5 0 top
R13  40.27,39.2 270 top
R14  51.67,19.2 180 top
R15  82.57,62.3 0 top
R16  69.57,61.2 0 top
R17  71.07,61.2 0 top
R18  68.17,61.2 0 top
R19  81.17,62.3 0 top
R20  69.57,58.4 180 top
R21  71.07,58.4 180 top
R22  68.17,58.4 180 top
R23  53.37,33.9 270 top
R24  77.07,42.2 270 top
R25  67.97,42.9 0 top
R26  66.37,42.9 0 top
R27  64.87,42.9 0 top
R28  90.17,42.1 270 top
R29  90.17,43.6 270 top
R30  49.57,33.9 270 top
SV1  87.07,52.3 90 top
SV2  87.07,53.7 90 top
SV3  87.07,55.1 90 top
T1  23.48,6.99 180 top
U1  48.25,7.62 270 top
U2  30.47,17.78 180 top
U3  78.57,58.8 180 top
U4  63.37,63.7 90 top
U$1  100,0 90 top
X1  7.29,67.31 0 top
X2  13.32,8.89 90 top
X3  52.07,26.6 90 top
XT1  38.41,3.17 0 top
XT2  72.37,45.9 180 top

### Tracks (layer width: path | path; a pad name or v marks a point on that pad's centre or on a via)
!RST  (via drill 0.2)
  Top 0.2: X3.6 50.13,29.14 v50.07,29.2 | v53.37,33.9 R23.2 | v52.87,40.2 v56.97,40.2 | v72.87,41 72.95,40.92 IC1.57
  Bottom 0.2: v50.07,29.2 50.07,31.4 52.57,33.9 v53.37,33.9 53.37,39.7 v52.87,40.2 | v56.97,40.2 64.57,40.2 66.57,42.2 71.67,42.2 v72.87,41
!SSD
  Top 0.2: IC1.30 77.75,21.68 70.07,14 70.07,7.07 JP1.4
AC_DET  (via drill 0.2)
  Top 0.2: IC1.6 61.58,33.79 59.27,36.1 48.87,36.1 48.37,35.6 v43.97,35.6 | v41.47,33.7 IC7.4
  Bottom 0.2: v43.97,35.6 43.37,35.6 v41.47,33.7
AC_SEL  (via drill 0.2)
  Top 0.2: v41.61,37.5 IC7.1 | v43.07,36.8 48.47,36.8 48.84,36.43 59.41,36.43 60.45,35.39 IC1.4
  Top 0.254: IC7.1 37.91,37.51 R10.1
  Bottom 0.2: v43.07,36.8 42.31,36.8 v41.61,37.5
AVCC
  Top 0.2: IC1.61 69.75,40.92 69.32,41.35 C31.1 L6.1
CAN_CS
  Top 0.2: IC1.17 67.35,18.42 60.04,11.1 55.67,11.1 54.73,10.16 U1.16
CAN_H
  Top 0.254: L1.P$2 15.88,16.21 15.23,15.56 15.23,14.29 X2.U$2 X2.P$2
CAN_INT
  Top 0.2: IC1.18 68.07,23.91 68.07,18.68 60.17,10.78 55.95,10.78 54.67,9.5 48.86,9.5 47.82,8.46
  Top 0.254: U1.12 51.19,5.08 47.82,8.46 R1.1
CAN_L
  Top 0.254: L1.P$1 16.15,18.71 X2.U$3 X2.P$3
CAN_MISO  (via drill 0.2)
  Top 0.2: v57.47,9.2 58.39,10.12 60.44,10.12 71.35,21.03 IC1.22 | v55.17,8.9 v55.16,8.89 U1.15
  Bottom 0.2: v57.47,9.2 57.17,8.9 v55.17,8.9
CAN_MOSI
  Top 0.2: IC1.21 70.55,20.7 60.31,10.45 57.37,10.45 56.47,9.55 56.47,8.8 55.29,7.62 U1.14
CAN_RST
  Top 0.2: IC1.16 65.55,17.08 59.9,11.43 U1.17
CAN_SCK
  Top 0.2: IC1.23 72.15,23.19 71.86,22.89 71.86,21.08 59.45,8.67 57.04,8.67 54.72,6.35 U1.13
CH0
  Top 0.2: R15.1 89.82,63.05 90.37,63.6 90.37,72.7 88.87,74.2 J1.2
CH1  (via drill 0.2)
  Top 0.2: R16.1 69.57,69.8 v69.47,69.9
  Bottom 0.2: v69.47,69.9 74.87,69.9 79.17,74.2 J2.2
CH2
  Top 0.2: R17.1 71.07,64.4 70.47,65 70.47,72.3 J3.2
DACA  (via drill 0.2)
  Top 0.2: IC1.8 72.58,32.19 v72.67,32.1 | v87.47,34 91.01,37.54 J7.1
  Bottom 0.2: v72.67,32.1 85.57,32.1 v87.47,34
DACB  (via drill 0.2)
  Top 0.2: IC1.9 72.58,31.39 v72.67,31.3 | v87.47,33.2 89.27,35 J7.2
  Bottom 0.2: v72.67,31.3 73.17,31.3 73.64,31.77 86.04,31.77 v87.47,33.2
FAN
  Top 0.2: IC7.11 47.57,33.7 47.77,33.9 R30.2 48.82,35.45 49.1,35.73 59.04,35.73 61.78,32.99 IC1.7
GND  (via drill 0.2, 0.2 pad 0.55, 0.35)
  Top 0.2: SV3.3 88.47,55.95 v88.47,60.3 | IC9.7 89.4,61.23 v88.47,60.3 | IC9.8 87.56,61.22 v88.47,60.3 | C22.2 84.02,55.2 v84.67,55.2 | R19.1 79.62,63.05 v79.57,63 | U3.1 79.87,57.8 | 79.87,57.8 79.77,57.8 79.47,58.1 v79.47,58.4 79.87,58.8 U3.3 | C23.2 79.62,57.55 79.87,57.8 | R22.1 R20.1 R21.1 72.02,57.65 v72.07,57.6 | v77.27,53.5 C24.2 78.56,52.75 IC3.5 79.44,52.47 80.39,53.42 IC3.2 | C25.2 v73.92,51.6 73.92,52.19 IC4.5 | C26.2 73.92,42.75 v73.57,43.1 | IC1.52 76.95,40.82 v76.87,40.9 | C28.2 83.62,34.2 82.47,34.2 82.08,34.59 IC1.44 79.88,34.59 v79.87,34.6 | IC1.34 82.18,26.59 82.47,26.3 83.62,26.3 C27.2 v83.67,27.17 | IC1.24 72.95,22.43 | C29.2 72.95,22.43 | 72.95,22.43 73.32,22.07 v73.32,21.95 | IC1.14 63.33,27.39 | 63.33,27.39 C30.2 | 63.33,27.39 62.97,27.02 v62.97,27 | C31.2 70.82,41.35 v70.55,41.08 IC1.60 | X3.2 50.17,26.6 v50.12,26.65 49.52,26.65 49.07,27.1 49.07,31.2 49.55,31.68 X3.10 | C33.2 71.67,45.05 XT2.2 71.72,44.35 v71.67,44.3 | XT2.4 74.27,46.8 74.47,46.6 v74.47,45.9 C32.2 | R29.1 v90.17,43.6 | v35.97,76.7 35.97,76.35 IC2.PAD 41.87,75.52 v41.87,76.3 | R30.1 v51.07,33.9
  Top 0.254: IC5.5 34.23,7.19 C6.2 C1.2 v30.57,5.63 29.6,5.63 27.29,7.94 v27.29,9.7 T1.1 | XT1.2 39.05,3.88 v38.37,3.2 37.76,2.58 XT1.4 37.7,2.22 36.82,2.22 36.62,2.42 C8.2 36.18,1.61 v36.17,1.6 | C9.2 40.63,1.74 v40.67,1.7 | U1.9 42.01,2.54 v41.97,2.5 | C7.2 50.36,13.71 v50.37,13.7 | v39.37,62 42.37,62 42.77,62.4 42.77,64.05 IC2.!ON/OFF | IC6.3 32.94,58.47 v33.37,58.9 | Q1.2 28.52,66.95 29.27,67.7 30.12,67.7 R7.1 30.17,68.7 30.77,69.3 v31.47,69.3 | C16.2 v43.77,39.2 | IC7.7 v41.16,29.89 v41.17,29.9 | K2.2 44.44,26.47 v44.37,26.4 | B1.- 46.25,21.55 C17.M 49.17,21.25 v49.17,20.3 49.52,19.95 R14.2 | v52.87,18.1 v52.88,18.09 IC8.4 55.77,18.09 56.12,17.75 C18.2
  Top 0.305: C19.M 84.07,67.3 v83.97,67.4 | C21.M v76.97,67.3 C20.M | SV1.3 SV2.3 SV3.3
  Top 0.406: Q2.3 88.8,45.87 88.57,46.1 88.57,46.6 | 88.57,46.6 88.57,47.2 | 88.57,47.2 v88.57,49 | Q2.2 88.64,46.53 88.57,46.6 | Q2.1 88.58,47.19 88.57,47.2
  Top 0.508: C12.2 61.07,67.2 v61.07,66.7 63.34,66.7 U4.HEATSINK 65.55,66.72 v65.57,66.7 | C13.2 v62.07,69.59 | v63.37,62.2 U4.3 v63.37,59.1 62.32,58.05 C15.M
  Top 1.016: v53.47,61.4 53.27,61.6 D3.P$2 | v39.34,66.8 IC2.PAD 39.34,73.44
  Top 1.27: 39.34,73.44 39.17,73.6 | v39.34,66.8 IC2.GROUND 39.34,62.03 v39.37,62
  Bottom 0.254: v33.37,58.9 39.17,58.9 39.97,58.1 C14.P$1 | v31.47,69.3 31.57,69.4 33.57,69.4
  Bottom 1.016: v53.47,61.4 51.67,59.6
  pour Bottom: 32.27,1.1 90.67,1.1 91.57,2 92.07,2.5 92.07,6.5 92.97,7.4 97.47,7.4 99.37,9.3 99.47,9.3 99.47,16.8 42.77,16.8 42.17,16.2 41.97,16 41.97,10.4 32.77,1.2 32.27,1.2
  pour Bottom: 40.27,1.2 25.07,1.2 24.47,1.8 24.47,9.3 24.27,9.5 24.27,12.3 24.77,12.8 28.47,12.8 28.67,12.6 28.67,12 31.07,9.6 38.27,9.6 41.57,12.9 41.57,16.5 41.87,16.8 42.77,16.8 42.77,3.7
  pour Bottom: 41.57,16.3 41.57,20.5 39.07,23 20.47,23 18.77,24.7 18.77,32.8 19.57,33.6 33.67,33.6 35.07,35 35.07,59.1 32.67,61.5 32.67,77.6 34.27,79.2 88.47,79.2 99.47,68.2 99.47,16.8 42.07,16.8
  pour Bottom: 19.37,33.5 15.07,37.8 14.57,37.8 7.07,37.8 6.27,37 6.27,21.8 7.37,20.7 17.97,20.7 20.27,23 20.27,32.6
INA
  Top 1.27: X2.P$9 X2.U$9 14.72,36.89 17.77,33.84 17.77,32.7 19.07,31.4 F1.P$1
INB
  Top 1.27: X2.P$8 X2.U$8 13.58,33.39 15.67,31.3 15.67,28.8 17.37,27.1 F2.P$1
INV_CTRL  (via drill 0.2)
  Top 0.2: 41.7,32.43 42.37,33.1 51.27,33.1 51.67,33.5 51.67,34.8 52.27,35.4 58.87,35.4 59.17,35.1 v59.17,34.6 | v61.97,34.6 IC1.5
  Top 0.254: IC7.5 41.7,32.43 | 42.37,33.1 42.37,38.4 41.57,39.2 R13.1
  Bottom 0.2: v59.17,34.6 v61.97,34.6
INV_EN
  Top 0.254: X2.P$6 X2.U$6 15.78,23.93 K2.4
ISOGND  (via drill 0.2)
  Top 0.254: C2.2 v14.28,6.35 | v32.37,16.51 U2.8 32.37,13.97 | U2.2 v31.1,19.27 | C3.2 32.37,13.97 | IC5.4 34.28,13.34 33.64,13.97 32.37,13.97 | T1.7 v19.67,13.65 | C4.2 39.13,16.12 C5.2 36.59,16.12 v36.57,16.1
  pour Bottom: 7.77,17.6 16.07,17.6 20.47,22 38.67,22 40.77,19.9 40.77,13.3 37.87,10.4 31.37,10.4 29.57,12.2 29.57,13.1 29.07,13.6 24.17,13.6 23.37,12.8 23.37,1.7 22.37,0.7 9.37,0.7 8.07,2 8.07,5.5 6.77,6.8 6.77,16.6
ISOVCC
  Top 0.254: T1.8 17.83,2.29 17.54,1.99 C2.1 14.28,2.86 15.23,3.81 18.09,3.81 22.53,8.26 22.53,20 24.44,21.91 29.52,21.91 29.83,21.59 U2.3 29.83,19.68 31.36,18.16 32.94,18.16 36.5,14.61 37.68,14.61 C5.1 | C3.1 37.34,10.68 38.09,11.43 IC5.1 38.09,13.38 37.69,13.78 C5.1 | C5.1 39.13,14.62 C4.1
LOAD_CTRL  (via drill 0.2)
  Top 0.2: v68.97,37.9 68.97,39.57 IC1.62
  Top 0.254: IC8.1 v52.87,21.9 52.87,20.9 53.14,20.64 IC8.2
  Bottom 0.2: v52.87,21.9 55.67,24.7 55.67,37.6 57.27,39.2 67.67,39.2 v68.97,37.9
MISOD
  Top 0.2: IC1.32 79.35,22.28 72.67,15.6 72.67,7.01 JP1.2
MOSID
  Top 0.2: IC1.31 78.55,21.98 71.27,14.7 71.27,8.41 JP1.3
N$1
  Top 0.254: D1.A 18.27,43.8 14.91,47.16 K1.S1
  Bottom 1.27: X1.PIN5 7.57,49.53 K1.S1
N$2
  Bottom 1.27: X1.PIN4 9.63,57.15 9.83,57.15 12.37,59.69 K1.O1
N$3
  Bottom 1.27: X1.PIN3 7.41,59.81 11.1,63.5 19.99,63.5 22.53,60.96 K1.O2
N$4
  Top 0.254: Q1.1 26.62,65.35 26.87,65.1 29.87,65.1 30.17,65.4 R7.2 30.17,66.5 30.57,66.9 31.37,66.9 31.67,67.2 R8.2
N$5
  Top 1.27: X1.PIN2 11.1,61 11.1,55.88 12.37,54.61 K1.P1
N$6
  Top 1.27: X1.PIN1 13.68,69.81 18.72,64.77 18.72,57.15 21.26,54.61 K1.P2
N$7
  Top 0.254: L1.P$3 28.9,18.71 31.1,16.51 U2.7
N$8
  Top 0.254: L1.P$4 27.31,16.21 27.93,16.83 29.2,16.83 29.83,16.19 U2.6
N$9
  Top 0.254: R12.1 36.17,29.3 38.03,31.16 IC7.6 IC7.9
N$10  (via drill 0.2)
  Top 0.2: IC6.4 28.7,60.53 29.42,61.25 R9.2
  Top 0.254: IC7.3 38.2,34.97 v38.17,35 | v34.47,53.9 32.97,55.4 29.87,55.4 28.7,56.57 IC6.4
  Bottom 0.254: v38.17,35 37.17,36 37.17,51.2 v34.47,53.9
N$11
  Top 0.254: U2.4 28.56,19.68 30.79,17.46 33.01,17.46 36.82,13.65 IC5.2
N$12
  Top 0.254: U1.8 40.74,3.81 | 40.74,3.81 C9.1 | XT1.3 39.05,2.87 39.36,3.17 40.31,3.17 40.74,3.61 40.74,3.81
N$13
  Top 0.254: U1.7 38.09,5.08 37.76,4.75 XT1.1 37.61,3.92 C8.1
N$14  (via drill 0.2)
  Top 0.254: v32.37,19.05 U2.1 | IC5.3 35.55,13.65 v33.64,15.56
  Bottom 0.254: v32.37,19.05 32.37,18.1 33.33,17.14 33.33,15.88 v33.64,15.56
N$15
  Top 0.254: IC6.1 28.47,48.7 26.67,48.7 26.22,48.25 R3.2
N$16
  Top 1.016: IC2.OUTPUT 37.64,61.13 38.57,60.2 43.67,60.2 45.07,61.6 D3.P$1 47.67,65.6 48.4,66.33 L2.1
N$17
  Top 0.254: K1.S2 24.6,51.6 29.47,51.6 31.24,49.83 IC6.2 31.02,48.71 C10.2
  Bottom 0.254: D2.A 17.81,41.75 17.81,44.81
  Bottom 1.27: X1.PIN6 17.81,44.81 K1.S2
N$18
  Bottom 0.254: R2.1 24.76,43.8 D1.C
N$19
  Top 0.254: C10.1 R3.1 27.72,45.05 27.17,44.5 27.17,41.4 27.77,40.8 R2.2
  Bottom 0.254: D2.C R2.2
N$21
  Top 0.152: LD1.1 R6.2
N$22
  Top 0.152: R6.1 11.32,75.75 13.58,78.01 D6.C
  Top 0.254: Q1.3 27.57,69.6 26.97,70.2 26.97,76.01 D6.C
  Bottom 0.406: K1.1 25.6,74.93 28.68,78.01 D6.C
N$23  (via drill 0.2)
  Top 0.254: IC7.2 38.23,36.24 v38.17,36.3 | v29.87,63.3 31.67,65.1 R8.1
  Bottom 0.254: v38.17,36.3 38.17,51.2 29.87,59.5 v29.87,63.3
N$24
  Top 0.254: R12.2 R11.2 38.72,24.75 39.07,25.1 42.87,25.1 44.04,23.93 K2.1
N$25
  Top 0.254: R11.1 37.77,26.8 39.67,28.7 42.07,28.7 43.26,29.89 IC7.8
N$26
  Top 0.2: IC9.11 86.7,59.27 86.87,59.1 86.87,52.7 87.27,52.3 SV1.2
N$27
  Top 0.254: IC8.6 58.41,19.36 58.17,19.6 58.17,20.3 58.51,20.64 IC8.7
N$28
  Top 0.254: B1.+ 47.14,18.83 47.52,18.45 C17.P R14.1 51.72,18.45 52.64,19.36 IC8.3
N$29
  Top 0.305: J1.1 88.92,69.31 C19.P L3.2
N$30
  Top 0.2: IC9.10 86.83,59.94 87.24,59.53 87.24,53.98 87.52,53.7 SV2.2
N$31
  Top 0.305: J2.1 81.92,69.21 C20.P L4.2
N$32
  Top 0.2: SV3.2 87.82,59.75 86.99,60.58 IC9.9
N$33
  Top 0.305: J3.1 72.37,69.2 72.12,68.95 C21.P 72.22,67.2 L5.2
N$34
  Top 0.2: IC4.3 71.47,53.19 | 71.47,53.19 71.38,53.19 70.87,53.7 D7.K D8.K | C25.1 71.97,50.7 71.47,51.2 71.47,53.19
N$35
  Top 0.2: IC9.1 92.55,57.32 95.97,53.9 J4.3
N$36
  Top 0.2: IC9.2 92.79,57.98 94.57,56.2 J4.2
N$37  (via drill 0.2)
  Top 0.2: R28.1 v90.17,42.1 | v87.67,49 87.47,49 86.97,49.5 75.68,49.5 75.25,49.07 69.69,49.07 69.29,49.47 49.25,49.47 45.65,45.87 44.87,45.87 44.57,45.57 v44.57,45.3 | v44.07,32.5 44.14,32.43 IC7.10
  Bottom 0.2: v90.17,42.1 88.37,43.9 88.37,48.3 v87.67,49 | v44.57,45.3 44.57,38.9 45.47,38 45.47,33.9 v44.07,32.5
N$38
  Top 0.2: IC9.3 92.88,58.61 93.17,58.9 95.81,58.9 J4.1
N$39
  Top 0.2: IC9.4 91.94,59.27 93.07,60.4 93.07,63.2 94.13,64.26 J5.3
N$40
  Top 0.2: IC9.5 91.81,59.94 92.57,60.7 92.57,65.6 93.77,66.8 J5.2
N$41
  Top 0.2: IC9.6 91.94,60.57 92.17,60.8 92.17,67.8 93.71,69.34 J5.1
N$43
  Top 0.2: C33.1 71.47,46.55 XT2.3 72.27,46.25 72.27,43.5 71.35,42.58 IC1.59
N$44
  Top 0.2: R19.2 R15.2 82.47,61.45 82.47,59.7 82.07,59.3 U3.4
N$45
  Top 0.2: R20.2 R16.2 69.57,60.9 69.87,61.2 78.37,61.2 79.77,59.8 U3.5
N$46
  Top 0.2: R21.2 71.07,60.4 | 71.07,60.4 R17.2 | U3.6 72.97,59.8 72.37,60.4 71.07,60.4
N$47
  Top 0.2: R18.2 R22.2 68.92,58.4 73.17,58.4 74.07,59.3 U3.7
N$50
  Top 0.2: C32.1 74.32,45 XT2.1 73.02,43.75 72.15,42.88 IC1.58
N$51
  Top 0.2: R25.1 67.97,44.1 67.67,44.4 44.37,44.4 42.47,46.3 40.77,46.3 40.57,46.1 LD2.B
N$52
  Top 0.2: LD2.R 63.37,43.6 64.17,42.8 66.17,42.8 66.47,43.1 66.47,43.55 R26.1
N$53
  Top 0.2: R27.1 64.12,43.65 63.77,44 43.87,44 42.47,45.4 LD2.G
N$54
  Top 0.2: IC1.63 68.15,41.97 R25.2
N$55
  Top 0.2: IC1.64 67.35,40.12 66.37,41.1 R26.2
N$56
  Top 0.2: IC1.1 65.55,40.62 64.87,41.3 R27.2
N$57
  Top 0.406: Q2.9 92.19,46.2 Q2.7 93.44,46.53 93.77,46.2 | J6.3 94.71,43.06 93.77,44 93.77,45 | Q2.8 93.08,47.19 93.77,46.5 93.77,46.2 | 93.77,45 93.77,45.6 | 93.77,45.6 93.77,46.2 | Q2.6 93.5,45.87 93.77,45.6 | Q2.5 93.56,45.21 93.77,45
N$59
  Top 0.2: Q2.4 89.42,45.09 R29.2 R28.2
PD0
  Top 0.2: IC1.26 74.57,23.97 74.57,21.3 65.07,11.8 65.07,6.99 JP1.8
PD1
  Top 0.2: IC1.27 75.35,21.38 66.23,12.26 JP1.7
PE4
  Top 0.2: IC1.40 83.33,31.39 87.08,27.64 87.08,19.79 88.07,18.8 91.5,18.8 JP2.4
PE5
  Top 0.2: JP2.3 87.93,20.24 87.41,20.77 87.41,27.78 83.47,31.71 82.66,31.71 82.18,32.19 IC1.41
RXCAN
  Top 0.254: IC5.7 36.82,8.75 37.29,9.22 39.79,9.22 42,11.43 U1.2
RXD
  Top 0.2: IC1.28 76.15,21.28 67.37,12.5 67.37,7.23 JP1.6
RXDE
  Top 0.2: IC1.38 84.01,29.79 86.42,27.37 86.42,17.65 87.57,16.5 91.74,16.5 JP2.6
RXDF
  Top 0.2: IC1.48 83.88,37.79 85.67,36 85.67,29.98 87.73,27.91 87.73,22.34 88.67,21.4 91.56,21.4 JP2.2
SCKD
  Top 0.2: IC1.33 80.36,25.79 80.17,25.6 80.17,22.5 73.85,16.18 JP1.1
SCL  (via drill 0.2)
  Top 0.2: IC9.13 83.45,57.98 v83.17,57.7 | U3.10 75.62,57.8 75.07,57.25 v75.07,56.7 75.07,55.1 | 75.07,55.1 75.07,52.6 75.77,51.9 79.77,51.9 80.34,52.47 IC3.1 82.44,52.47 v82.47,52.5 | IC4.8 73.93,55.1 75.07,55.1 | v79.2,33.6 79.2,29.27 79.48,28.99 IC1.37 82.18,28.99 82.44,28.73 84.61,28.73 86.1,27.23 86.1,17.17 88.11,15.16 JP2.7
  Bottom 0.2: v83.17,57.7 83,57.87 75.74,57.87 75.07,57.2 v75.07,56.7 | v79.2,33.6 79.2,36.17 79.07,36.3 79.07,50.7 80.87,52.5 v82.47,52.5
SDA  (via drill 0.2)
  Top 0.2: IC9.12 83.64,58.63 83.12,59.15 v83.17,59.2 | U3.9 74.77,58.3 v74.27,57.8 73.97,57.8 71.77,55.6 71.77,55.2 71.98,54.99 IC4.1 | v85.17,56.4 83.97,56.4 81.94,54.37 IC3.3 81.31,54.4 v80.17,54.4 | v78.67,34.8 78.67,28.9 79.38,28.19 IC1.36 82.16,28.19 82.37,28.4 84.47,28.4 85.77,27.1 85.77,16.9 88.87,13.8 91.58,13.8 JP2.8
  Bottom 0.2: v83.17,59.2 83.17,59.1 | 83.17,59.1 83.17,58.9 79.72,58.9 79.69,58.93 75.4,58.93 v74.27,57.8 | v85.17,56.4 85.17,58.3 84.27,59.2 83.27,59.2 83.17,59.1 | v78.67,34.8 78.67,52.9 v80.17,54.4
T1
  Top 0.254: X2.P$5 X2.U$5 22.66,22.89 23.17,23.4 35.27,23.4 37.3,21.37 B1.AC2
T2
  Top 0.254: X2.P$4 X2.U$4 15.93,22 22.77,22 23.67,22.9 34.57,22.9 38.64,18.83 B1.AC1
TCK  (via drill 0.2)
  Top 0.2: X3.1 59.87,26.6 v60.57,27.3 | v61.87,29.2 63.77,29.2 64.07,28.9 65.47,28.9 IC1.12
  Bottom 0.2: v60.57,27.3 60.57,27.9 v61.87,29.2
TDI  (via drill 0.2)
  Top 0.2: X3.9 58.99,31.68 v60.17,30.5 | v63.17,29.9 65.44,29.9 IC1.11
  Bottom 0.2: v60.17,30.5 62.57,30.5 v63.17,29.9
TDO
  Top 0.2: IC1.56 73.75,30.58 71.37,28.2 65.56,28.2 IC1.13 63.88,28.19 63.57,28.5 60.57,28.5 59.87,27.8 56.14,27.8 X3.3
TMS
  Top 0.2: X3.5 60.41,29.14 61.86,30.59 IC1.10
TXCAN
  Top 0.254: IC5.6 35.57,7.17 35.57,8.3 36.87,9.6 39.57,9.6 41.17,11.2 41.17,12.2 41.67,12.7 U1.1
TXD
  Top 0.2: IC1.29 76.95,21.48 68.77,13.3 JP1.5
TXDE
  Top 0.2: JP2.5 87.35,17.7 86.75,18.3 86.75,27.51 84.14,30.11 83.36,30.11 82.87,30.6 81.17,30.6 IC1.39
TXDF
  Top 0.2: JP2.1 89.18,22.78 88.06,23.9 88.06,28.05 86,30.11 86,36.13 84.02,38.11 82.95,38.11 81.48,39.59 IC1.49
V_BAT
  Top 0.2: B2.P$1 48.47,51.9 D8.A
V_IN  (via drill 0.2)
  Top 0.152: LD1.2 9.92,75 11.37,75 12.57,76.2 13.64,76.2 K1.2
  Top 0.254: IC2.V_IN 35.94,66.14 35.07,67 33.87,67 | D6.A 32.48,70.39 33.27,69.6 | K2.3 39.9,26.4 39.07,26.4 38.77,26.1 38.77,25.7 38.57,25.5 33.87,25.5 33.27,26.1 D5.P$1 | 35.94,59.5 37.37,59.5 37.77,59.1 39.17,59.1 39.22,59.15 55.32,59.15 59.27,63.1 v59.67,63.1 | R18.1 v68.17,61.2
  Top 0.305: 33.27,69.6 33.27,67.6 33.87,67
  Top 0.406: J6.1 96.03,48.14 94.17,50 75.57,50 75.07,49.5 69.87,49.5 69.47,49.9 49.07,49.9 45.47,46.3 43.08,46.3 42.65,46.73 42.64,46.73 39.47,49.9 v39.47,54.5
  Top 1.016: IC2.V_IN 35.94,59.5 35.94,57.23 C14.P$2
  Top 1.27: D5.P$1 D4.P$1 34.87,31.4 36.37,32.9 C14.P$2
  Bottom 0.254: v59.67,63.1 64.27,63.1 66.17,61.2 v68.17,61.2
  Bottom 0.406: K1.2 17.34,72.5 26.67,72.5 28.78,70.39 D6.A | v39.47,54.5 37.17,56.8 C14.P$2
VBAT
  Top 0.2: R24.1 77.82,39.66 IC1.51
VCC3V3  (via drill 0.2, 0.35)
  Top 0.2: C22.1 SV3.1 86.32,56.55 85.55,57.32 IC9.14 84.63,57.3 83.52,57.3 83.39,57.17 82.94,57.17 81.07,55.3 78.97,55.3 78.84,55.16 IC3.4 78.72,54.25 C24.1 v77.27,55.1 | R10.2 37.87,57.3 39.37,58.8 56.67,58.8 60.27,55.2 64.17,55.2 v64.57,54.8 | C28.1 82.62,35.75 82.26,35.39 IC1.45 77.98,35.39 | C27.1 82.62,27.85 82.16,27.39 IC1.35 78.07,27.39 | C29.1 73.75,22.27 IC1.25 73.75,25.92 73.12,26.55 | 77.98,35.39 76.15,37.22 IC1.53 76.15,41.18 76.32,41.35 R24.2 C26.1 v74.67,42.2 | 78.07,27.39 73.96,27.39 73.12,26.55 | 73.12,26.55 73.07,26.5 65.64,26.5 IC1.15 63.31,26.59 C30.1 60.32,26.25 59.77,25.7 54.57,25.7 | 77.98,35.39 77.98,27.48 78.07,27.39 | 54.57,25.7 54.42,25.85 | 54.42,25.85 54.07,26.2 54.07,27.9 | X3.7 54.38,30.41 | 54.07,27.9 54.07,30.1 54.38,30.41 | X3.4 54.04,27.87 54.07,27.9 | 38.57,43.6 38.57,57.2 39.57,58.2 56.47,58.2 59.97,54.7 64.47,54.7 v64.57,54.8 | 38.57,43.6 38.57,42 39.87,40.7 44.67,40.7 46.77,38.6 v48.27,38.6 | 54.37,25.8 54.42,25.85 | v53.97,24.9 53.97,25.1 54.57,25.7 | 54.38,30.41 54.12,30.67 R23.1 | L6.2 70.17,43.6 v70.07,43.7 | JP1.10 63.57,5.83 | 63.57,5.83 59.3,5.83 54.87,1.4 50.67,1.4 45.52,6.55 v45.52,8.95 | LD2.A 38.57,43.6 | JP2.10 92.94,9.87 85.87,2.8 66.6,2.8 63.57,5.83 | v64.57,54.8 65.67,53.7 D7.A 66.92,54.45 67.47,55 70.47,55 v70.97,54.5 | v66.97,71.5 67.57,70.9 67.57,62.8 66.97,62.2 66.97,57.4 66.37,56.8 65.42,56.8 | IC7.13 47.73,36.24 v47.77,36.2
  Top 0.254: T1.3 24.75,8.57 30.7,2.63 C1.1 v32.37,3.81 | v32.37,7.92 C6.1 | C7.1 51.86,13.02 | 51.86,13.02 52.17,12.7 U1.18 55.97,12.7 57.62,14.35 C18.1 | IC5.8 38.09,8.38 v38.07,8.4 | R1.2 49.32,12.74 v49.27,12.7 49.59,13.02 51.86,13.02 | R9.1 31.77,63.6 v31.87,63.7 | R10.2 38.02,39.2 R13.2 39.52,39.8 39.82,40.1 42.67,40.1 43.02,39.75 C16.1 43.02,37.95 43.46,37.51 IC7.14 45.85,37.5 v47.37,37.5 | v48.07,24.2 49.27,24.2 49.97,23.5 56.07,23.5 56.97,22.6 56.97,21.9 | 56.97,21.9 56.97,19.2 57.62,18.55 C18.1 | IC8.8 56.98,21.91 56.97,21.9 | 57.7,16.43 C18.1
  Top 0.305: SV1.1 SV2.1 SV3.1
  Top 0.508: U4.4 64.62,58.95 65.42,58.15 C15.P 65.42,56.8 65.42,55.65 v64.57,54.8
  Bottom 0.2: v48.07,24.2 47.77,24.5 v47.77,36.2 47.77,36.8 47.37,37.2 v47.37,37.5 | v48.27,38.6 48.27,38 48.97,37.3 48.97,25.5 49.57,24.9 v53.97,24.9 | v74.67,42.2 74.4,42.47 74.4,43.22 73.92,43.7 v70.07,43.7 | 62.07,78.3 63.97,76.4 63.97,73.4 65.87,71.5 v66.97,71.5 | v70.97,54.5 76.67,54.5 v77.27,55.1
  Bottom 0.254: v32.37,3.81 v32.37,7.92 37.59,7.92 v38.07,8.4 44.97,8.4 v45.52,8.95 v49.27,12.7 | v31.87,63.7 31.87,66.8 30.47,68.2 30.47,76.6 32.77,78.9 61.47,78.9 62.07,78.3
VCC5V  (via drill 0.2, 0.35)
  Top 0.2: C23.1 78.12,58.8 | 78.12,58.8 78.12,59.95 77.57,60.5 v73.87,60.5 | v73.67,63.4 73.67,64.85 L5.1 L4.1 81.42,63.9 82.57,63.9 83.57,64.9 L3.1 | U3.8 78.12,58.8
  Top 0.254: C13.1 61.97,70.45 61.97,71.1
  Top 0.508: IC2.FEEDBACK 41.04,65.86 41.87,66.7 43.57,66.7 v43.67,66.6 | v60.07,69.6 60.17,69.7 C12.1 61.97,71.1 65.27,71.1 66.77,69.6 66.77,65.6 v65.37,64.2 63.57,64.2 62.12,62.75 U4.2 U4.1
  Top 1.016: L2.2 61.09,76.28 C11.P$2 60.17,73.4 C12.1
  Bottom 0.2: v73.87,60.5 73.87,63.2 v73.67,63.4 66.17,63.4 v65.37,64.2
  Bottom 0.508: v43.67,66.6 57.07,66.6 v60.07,69.6
VCC_A
  Top 1.27: F1.P$2 D4.P$2
VCC_B
  Top 1.27: F2.P$2 D5.P$2

### Text on the board
tNames: AC_OUT | INV_IN | AC_IN | VA | GND | VB | inv | T1 | RXF | TXF | PE5 | PE4 | T2 | TXE | RXE | SCL | SDA | L | GND | 3V3 | H | Gnd | PD1 | TXD | MOSI | SCK | G | 3v3 | !CS | PD0 | RXD | MISO